# Altium project FMC_DAC_PSU.PrjPCB
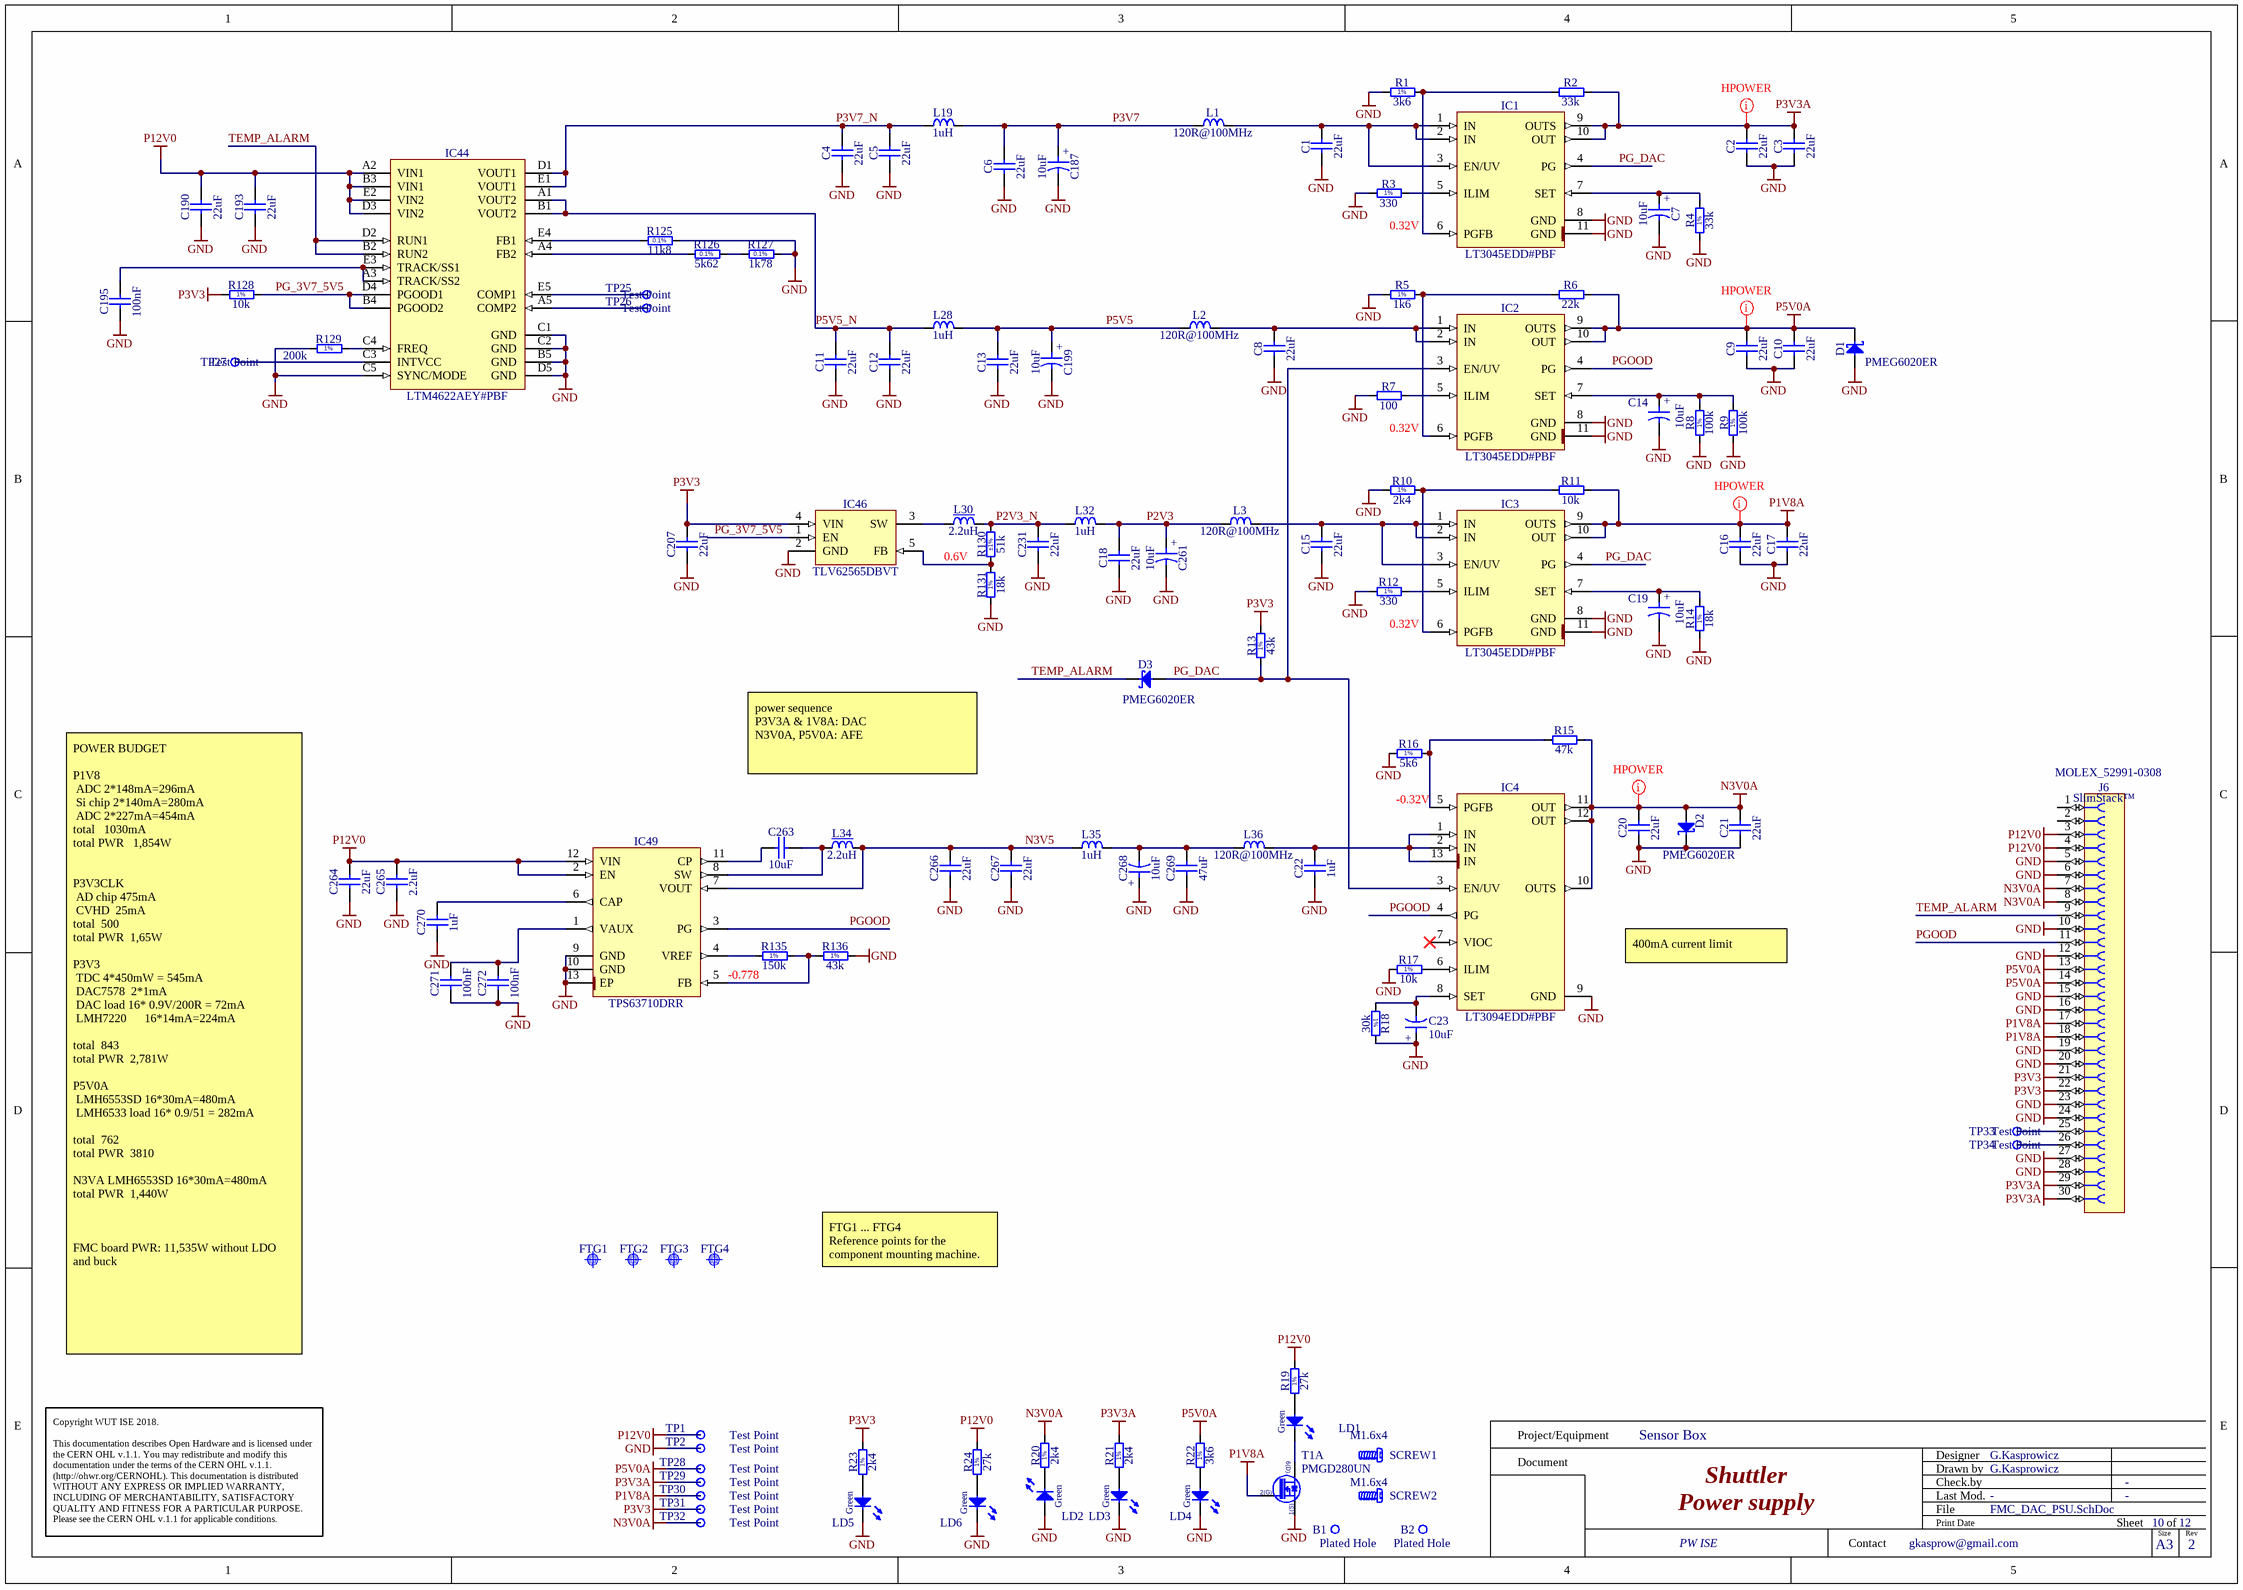
[diagram p0: FMC_DAC_PSU.SchDoc]
P_version: 1.2
1 sheet, 122 parts. Net scope: hierarchical (ports join the sheet entries above them; power ports are global).
Board file: FMC_DAC_PSU.PcbDoc

## Sheet FMC_DAC_PSU.SchDoc: Shuttler
size 420 x 297 mm; Author: G.Kasprowicz; CompanyName: WUT ISE; DrawnBy: G.Kasprowicz; Organization: WUT ISE; Address1: PW ISE; Address2: Nowowiejska 15/19 00-665 Warsaw; Address3: gkasprow@gmail.com; DocumentNumber: 10; Revision: 2; SheetNumber: 10; SheetTotal: 12; ModifiedBy: -; CheckedDate: -; Title2: Power supply; DivGrp: WUT ISE; Designer: G.Kasprowicz; ModifiedDate: -; ProjectName: Sensor Box

### Parts
B1  Plated Hole  [c300h160]  (no BOM)
B2  Plated Hole  [c300h160]  (no BOM)
C1  22uF  [CAPC2012X135N]
C2  22uF  [CAPC2012X135N]
C3  22uF  [CAPC2012X135N]
C4  22uF  [CAPC2012X135N]
C5  22uF  [CAPC2012X135N]
C6  22uF  [CAPC2012X135N]
C7  10uF  [CAPMP3216X180N]
C8  22uF  [CAPC2012X135N]
C9  22uF  [CAPC2012X135N]
C10  22uF  [CAPC2012X135N]
C11  22uF  [CAPC2012X135N]
C12  22uF  [CAPC2012X135N]
C13  22uF  [CAPC2012X135N]
C14  10uF  [CAPMP3216X180N]
C15  22uF  [CAPC2012X135N]
C16  22uF  [CAPC2012X135N]
C17  22uF  [CAPC2012X135N]
C18  22uF  [CAPC2012X135N]
C19  10uF  [CAPMP3216X180N]
C20  22uF  [CAPC2012X135N]
C21  22uF  [CAPC2012X135N]
C22  1uF  [CAPC1608X87N]
C23  10uF  [CAPMP3216X180N]
C187  10uF  [CAPMP3216X180N]
C190  22uF  [CAPC2012X135N]
C193  22uF  [CAPC2012X135N]
C195  100nF  [CAPC1005X55N]
C199  10uF  [CAPMP3216X180N]
C207  22uF  [CAPC2012X135N]
C231  22uF  [CAPC2012X135N]
C261  10uF  [CAPMP3216X180N]
C263  10uF  [CAPC2012X135N]
C264  22uF  [CAPC2012X135N]
C265  2.2uF  [CAPC1608X87N]
C266  22uF  [CAPC2012X135N]
C267  22uF  [CAPC2012X135N]
C268  10uF  [CAPMP3216X180N]
C269  47uF  [CAPC2012X140N]
C270  1uF  [CAPC1608X87N]
C271  100nF  [CAPC1005X55N]
C272  100nF  [CAPC1005X55N]
D1  PMEG6020ER  [SODFL3517X110N]
D2  PMEG6020ER  [SODFL3517X110N]
D3  PMEG6020ER  [SODFL3517X110N]
FTG1  Use only in PCB  [FIDUCIAL_TOP_S100-200]  (value not drawn)
FTG2  Use only in PCB  [FIDUCIAL_TOP_C100-200]  (value not drawn)
FTG3  Use only in PCB  [FIDUCIAL_TOP_S100-200]  (value not drawn)
FTG4  Use only in PCB  [FIDUCIAL_TOP_C100-200]  (value not drawn)
IC1  LT3045EDD#PBF  [SON50P300X300X80-11N-R175X248]
IC2  LT3045EDD#PBF  [SON50P300X300X80-11N-R175X248]
IC3  LT3045EDD#PBF  [SON50P300X300X80-11N-R175X248]
IC4  LT3094EDD#PBF  [SON45P300X300X80-13N-R175X248]
IC44  LTM4622AEY#PBF  [BGA25C127P5X5_625X625X262]
IC46  TLV62565DBVT  [SOT95P280X145-5N]
IC49  TPS63710DRR  [SON50P300X300X80-13N-R160X260]
J6  SlimStack™  [MOLEX_52991-0308]
L1  120R@100MHz  [INDC1608X65N]
L2  120R@100MHz  [INDC1608X65N]
L3  120R@100MHz  [INDC1608X65N]
L19  1uH  [INDC2620X100N]
L28  1uH  [INDC2620X100N]
L30  2.2uH  [IND_WURTH_WE-TPC_4828]
L32  1uH  [INDC2620X100N]
L34  2.2uH  [IND_WURTH_WE-TPC_4828]
L35  1uH  [INDC2620X100N]
L36  120R@100MHz  [INDC1608X65N]
LD1  Green  [LED_KINGBRIGHT_KPH-1608CGCK]
LD2  Green  [LED_KINGBRIGHT_KPH-1608CGCK]
LD3  Green  [LED_KINGBRIGHT_KPH-1608CGCK]
LD4  Green  [LED_KINGBRIGHT_KPH-1608CGCK]
LD5  Green  [LED_KINGBRIGHT_KPH-1608CGCK]
LD6  Green  [LED_KINGBRIGHT_KPH-1608CGCK]
R1  3k6  [RESC1005X40N]
R2  33k  [RESC1005X40N]
R3  330  [RESC1005X40N]
R4  33k  [RESC1608X55N]
R5  1k6  [RESC1005X40N]
R6  22k  [RESC1005X40N]
R7  100  [RESC1005X40N]
R8  100k  [RESC1005X40N]
R9  100k  [RESC1005X40N]
R10  2k4  [RESC1005X40N]
R11  10k  [RESC1005X40N]
R12  330  [RESC1005X40N]
R13  43k  [RESC1005X40N]
R14  18k  [RESC1608X55N]
R15  47k  [RESC1005X40N]
R16  5k6  [RESC1005X40N]
R17  10k  [RESC1005X40N]
R18  30k  [RESC1608X55N]
R19  27k  [RESC1005X40N]
R20  2k4  [RESC1005X40N]
R21  2k4  [RESC1005X40N]
R22  3k6  [RESC1005X40N]
R23  2k4  [RESC1005X40N]
R24  27k  [RESC1005X40N]
R125  11k8  [RESC1608X55N]
R126  5k62  [RESC1608X55N]
R127  1k78  [RESC1608X55N]
R128  10k  [RESC1005X40N]
R129  200k  [RESC1005X40N]
R130  51k  Tolerance: ±1%  [RESC1005X40N]
R131  18k  [RESC1005X40N]
R135  150k  [RESC1005X40N]
R136  43k  [RESC1005X40N]
SCREW1  M1.6x4  [BOSSARD_B1.6X4/BN660_v]
SCREW2  M1.6x4  [BOSSARD_B1.6X4/BN660_v]
T1  PMGD280UN  [SOT65P210X110-6N]  (part A of 2)
TP1  Test Point  [TPS127]  (no BOM)
TP2  Test Point  [TPS127]  (no BOM)
TP25  Test Point  [TPS127]  (no BOM)
TP26  Test Point  [TPS127]  (no BOM)
TP27  Test Point  [TPS127]  (no BOM)
TP28  Test Point  [TPS127]  (no BOM)
TP29  Test Point  [TPS127]  (no BOM)
TP30  Test Point  [TPS127]  (no BOM)
TP31  Test Point  [TPS127]  (no BOM)
TP32  Test Point  [TPS127]  (no BOM)
TP33  Test Point  [TPS127]  (no BOM)
TP34  Test Point  [TPS127]  (no BOM)

### Nets
GND: C1.1 C2.1 C3.1 C4.1 C5.1 C6.1 C7.2 C8.1 C9.1 C10.1 C11.1 C12.1 C13.1 C14.2 C15.1 C16.1 C17.1 C18.1 C19.2 C20.1 C21.1 C22.1 C23.1 C187.2 C190.1 C193.1 C195.1 C199.2 C207.1 C231.1 C261.2 C264.1 C265.1 C266.1 C267.1 C268.1 C269.1 C270.1 C271.1 C272.1 D1.2(A) D2.1(C) IC1.8(GND) IC1.11(GND) IC2.8(GND) IC2.11(GND) IC3.8(GND) IC3.11(GND) IC4.9(GND) IC44.B5(GND) IC44.C1(GND) IC44.C2(GND) IC44.C5(SYNC/MODE) IC44.D5(GND) IC46.2(GND) IC49.9(GND) IC49.10(GND) IC49.13(EP) J6.5 J6.6 J6.10 J6.12 J6.15 J6.16 J6.19 J6.20 J6.23 J6.24 J6.27 J6.28 LD2.2(A) LD3.1(C) LD4.1(C) LD5.1(C) LD6.1(C) R1.1 R3.1 R4.1 R5.1 R7.1 R8.1 R9.1 R10.1 R12.1 R14.1 R16.1 R17.1 R18.2 R125.2 R127.2 R129.1 R131.1 R136.2 T1.1(S) TP2.1
N3V0A: C20.2 C21.2 D2.2(A) IC4.10(OUTS) IC4.11(OUT) IC4.12(OUT) J6.7 J6.8 R15.2 R20.2 TP32.1
P1V8A: C16.2 C17.2 IC3.9(OUTS) IC3.10(OUT) J6.17 J6.18 R11.2 T1.2(G) TP30.1
P3V3: C207.2 IC46.4(VIN) J6.21 J6.22 R13.2 R23.2 R128.1 TP31.1
P3V3A: C2.2 C3.2 IC1.9(OUTS) IC1.10(OUT) J6.29 J6.30 R2.2 R21.2 TP29.1
P5V0A: C9.2 C10.2 D1.1(C) IC2.9(OUTS) IC2.10(OUT) J6.13 J6.14 R6.2 R22.2 TP28.1
P12V0: C190.2 C193.2 C264.2 C265.2 IC44.A2(VIN1) IC44.B3(VIN1) IC44.D3(VIN2) IC44.E2(VIN2) IC49.2(EN) IC49.12(VIN) J6.3 J6.4 R19.2 R24.2 TP1.1
N3V5: C266.2 C267.2 IC49.7(VOUT) L34.2 L35.1
P2V3: C18.2 C261.1 L3.1 L32.2
P2V3_N: C231.2 L30.2 L32.1 R130.2
P3V7: C6.2 C187.1 L1.1 L19.2
P3V7_N: C4.2 C5.2 IC44.D1(VOUT1) IC44.E1(VOUT1) L19.1
P5V5: C13.2 C199.1 L2.1 L28.2
P5V5_N: C11.2 C12.2 IC44.A1(VOUT2) IC44.B1(VOUT2) L28.1
PG_3V7_5V5: IC44.B4(PGOOD2) IC44.D4(PGOOD1) IC46.1(EN) R128.2
PG_DAC: D3.2(A) IC1.4(PG) IC2.3(EN/UV) IC3.4(PG) IC4.3(EN/UV) R13.1
PGOOD: IC2.4(PG) IC4.4(PG) IC49.3(PG) J6.11
TEMP_ALARM: D3.1(C) IC44.B2(RUN2) IC44.D2(RUN1) J6.9
NetC1_2: C1.2 IC1.1(IN) IC1.2(IN) IC1.3(EN/UV) L1.2
NetC7_1: C7.1 IC1.7(SET) R4.2
NetC8_2: C8.2 IC2.1(IN) IC2.2(IN) L2.2
NetC14_1: C14.1 IC2.7(SET) R8.2 R9.2
NetC15_2: C15.2 IC3.1(IN) IC3.2(IN) IC3.3(EN/UV) L3.2
NetC19_1: C19.1 IC3.7(SET) R14.2
NetC22_2: C22.2 IC4.1(IN) IC4.2(IN) IC4.13(IN) L36.2
NetC23_2: C23.2 IC4.8(SET) R18.1
NetC195_2: C195.2 IC44.A3(TRACK/SS2) IC44.E3(TRACK/SS1)
NetC263_1: C263.1 IC49.11(CP)
NetC263_2: C263.2 IC49.8(SW) L34.1
NetC268_2: C268.2 C269.2 L35.2 L36.1
NetC270_2: C270.2 IC49.6(CAP)
NetC271_2: C271.2 C272.2 IC49.1(VAUX)
NetIC1_5: IC1.5(ILIM) R3.2
NetIC1_6: IC1.6(PGFB) R1.2 R2.1
NetIC2_5: IC2.5(ILIM) R7.2
NetIC2_6: IC2.6(PGFB) R5.2 R6.1
NetIC3_5: IC3.5(ILIM) R12.2
NetIC3_6: IC3.6(PGFB) R10.2 R11.1
NetIC4_5: IC4.5(PGFB) R15.1 R16.2
NetIC4_6: IC4.6(ILIM) R17.2
NetIC44_A4: IC44.A4(FB2) R126.1
NetIC44_A5: IC44.A5(COMP2) TP26.1
NetIC44_C3: IC44.C3(INTVCC) TP27.1
NetIC44_C4: IC44.C4(FREQ) R129.2
NetIC44_E4: IC44.E4(FB1) R125.1
NetIC44_E5: IC44.E5(COMP1) TP25.1
NetIC46_3: IC46.3(SW) L30.1
NetIC46_5: IC46.5(FB) R130.1 R131.2
NetIC49_4: IC49.4(VREF) R135.1
NetIC49_5: IC49.5(FB) R135.2 R136.1
NetJ6_25: J6.25 TP33.1
NetJ6_26: J6.26 TP34.1
NetLD1_1: LD1.1(C) T1.6(D)
NetLD1_2: LD1.2(A) R19.1
NetLD2_1: LD2.1(C) R20.1
NetLD3_2: LD3.2(A) R21.1
NetLD4_2: LD4.2(A) R22.1
NetLD5_2: LD5.2(A) R23.1
NetLD6_2: LD6.2(A) R24.1
NetR126_2: R126.2 R127.1

Not connected (* = marked no-connect by the designer): B1 1; B2 1; IC4 7(VIOC)*; J6 1 2

### Layout directives
net class Hpower: N3V0A, P1V8A, P3V3A, P5V0A

### Notes on the sheet
- 0.32V
- 0.6V
- power sequence
  P3V3A & 1V8A: DAC
  N3V0A, P5V0A: AFE
- -0.32V
- (near R135) -0.778
- 400mA current limit
- FTG1 ... FTG4
  Reference points for the component mounting machine.
- (near C264) POWER BUDGET
  P1V8
  ADC	2*148mA=296mA
  Si chip	2*140mA=280mA
  ADC	2*227mA=454mA
  total			1030mA
  total PWR			1,854W
  P3V3CLK
  AD chip	475mA
  CVHD 	25mA
  total		500
  total PWR		1,65W
  P3V3
  TDC	4*450mW = 545mA
  DAC7578	 2*1mA
  DAC load	16* 0.9V/200R = 72mA
  LMH7220	     16*14mA=224mA
  total		843
  total PWR		2,781W
  P5V0A
  LMH6553SD 16*30mA=480mA
  LMH6533 load 16* 0.9/51 = 282mA
  total		762
  total PWR		3810
  N3VA	LMH6553SD 16*30mA=480mA
  total PWR		1,440W
  FMC board PWR: 11,535W without LDO and buck
- Project/Equipment
- Document
- Designer
- Drawn by
- Check.by
- Copyright WUT ISE 2018.
  This documentation describes Open Hardware and is licensed under the CERN OHL v.1.1. You may redistribute and modify this documentation under the terms of the CERN OHL v.1.1. (http://ohwr.org/CERNOHL). This documentation is distributed WITHOUT ANY EXPRESS OR IMPLIED WARRANTY, INCLUDING OF MERCHANTABILITY, SATISFACTORY QUALITY AND FITNESS FOR A PARTICULAR PURPOSE. Please see the CERN OHL v.1.1 for applicable conditions.
- Contact
- File
- Last Mod.
- Print Date
- Sheet
- Size
- A3
- of
- Rev
- (in symbol CTE3216-18_10UF_10V_10%_LESR1800) +
- (in symbol CTE3216-18_10UF_16V_20%_AVX_TCJ) +
- (in symbol PMGD280UN, part A) 6(D); 2(G); 1(S)
- (in symbol R0402_1K6_1%_0.0625W_100PPM) 1%
- (in symbol R0402_2K4_1%_0.0625W_100PPM) 1%
- (in symbol R0402_3K6_1%_0.0625W_100PPM) 1%
- (in symbol R0402_5K6_1%_0.0625W_100PPM) 1%
- (in symbol R0402_10K_1%_0.0625W_100PPM) 1%
- (in symbol R0402_10k_1%_0.0625W_100PPM) 1%
- (in symbol R0402_18K_1%_0.0625W_100PPM) 1%
- (in symbol R0402_27K_1%_0.0625W_100PPM) 1%
- (in symbol R0402_43K_1%_0.0625W_100PPM) 1%
- (in symbol R0402_100K_1%_0.0625W_100PPM) 1%
- (in symbol R0402_150K_1%_0.0625W_100PPM) 1%
- (in symbol R0402_200K_1%_0.0625W_100PPM) 1%
- (in symbol R0402_330R_1%_0.0625W_100PPM) 1%
- (in symbol R0603_1K78_0.1%_0.063W_10PPM) 0.1%
- (in symbol R0603_5K62_0.1%_0.063W_10PPM) 0.1%
- (in symbol R0603_11K8_0.1%_0.063W_10PPM) 0.1%
- (in symbol R0603_18k_1%_0.1W_100PPM) 1%
- (in symbol R0603_30k_1%_0.1W_100PPM) 1%
- (in symbol R0603_33k_1%_0.1W_100PPM) 1%

### Library data of the parts
B1 B2 = PLATED_HOLE1.6_PAD3.0: Single Terminal Socket; Part Description: Plated Through Hole: Hole Dia.=1.6mm Pad Dia.=3.0mm; Mounted: No; Part Number: PLATED_HOLE1.6_PAD3.0; Component Type: Standard (No BOM); Pin Count: 1; Family: Plated Hole; Socket: No; SMD: No; Sense: No; Status: None; ComponentHeight: 0mm; HelpURL: Undefined; Author: CERN DEM JMW; CreateDate: 05.11.2009; LatestRevisionDate: 05.11.2009; PackageDescription: Plated Through Hole: Hole Dia.=1.6mm Pad Dia.=3.0mm
C1-C6 C8-C13 C15-C18 C20 C21 C190 C193 C207 C231 C264 C266 C267 = CC0805_22UF_16V_10%_X5R: Non-polarised capacitor; Part Description: SMD Multilayer Chip Ceramic Capacitor; Manufacturer: GENERIC; Manufacturer1 Part Number: C2012X5R1C226KT; Voltage: 16V; TC: X5R; Tolerance: ±10%; Part Number: CC0805_22UF_16V_10%_X5R; Component Kind: Standard; Component Type: Standard; Pin Count: 2; Value: 22uF; Status: Preferred; Manufacturer Part Number: CC0805_22UF_16V_10%_X5R; Case: 0805; Mounted: Yes; Socket: No; SMD: Yes; Sense: No; Manufacturer1 Example: TDK; Manufacturer1 ComponentHeight: 1.35mm; HelpURL: \\cern.ch\dfs\Applications\Altium\Datasheets\CC0805_X5R_TDK_C.pdf; Author: CERN DEM JLC; CreateDate: 25.10.2012; LatestRevisionDate: 25.10.2012
C7 C14 C19 C23 = CTE3216-18_10UF_16V_20%_AVX_TCJ: Polarised capacitor; Part Description: ESR 0R200 Tantalum Solid Electrolytic Chip Capacitor with Conductive Polymer Electrode; Manufacturer: AVX; Manufacturer Part Number: TCJA106M016R0200; Voltage: 16V; Tolerance: ±20%; Part Number: CTE3216-18_10UF_16V_20%_AVX_TCJ; Component Kind: Standard; Component Type: Standard; Pin Count: 2; Value: 10uF; Status: Preferred; Case: A; Mounted: Yes; Socket: No; SMD: Yes; Sense: No; ComponentHeight: 1.8mm; HelpURL: \\cern.ch\dfs\Applications\Altium\Datasheets\CTE_AVX_TCJ.pdf; Author: CERN DEM JLC; CreateDate: 29.03.2012; LatestRevisionDate: 29.03.2012
C22 = CC0603_1UF_25V_10%_X7R: Non-polarised capacitor; Part Description: SMD Multilayer Chip Ceramic Capacitor; Manufacturer: GENERIC; Manufacturer1 Part Number: GRM188R71E105KA12D; Voltage: 25V; TC: X7R; Tolerance: ±10%; Part Number: CC0603_1UF_25V_10%_X7R; Component Kind: Standard; Component Type: Standard; Pin Count: 2; Value: 1uF; Status: None; Manufacturer Part Number: CC0603_1UF_25V_10%_X7R; Case: 0603; Mounted: Yes; Socket: No; SMD: Yes; Sense: No; Manufacturer1 Example: MURATA; Manufacturer1 ComponentHeight: 0.9mm; HelpURL: \\cern.ch\dfs\Applications\Altium\Datasheets\CC0603_X7R_MURATA.pdf; Author: CERN DEM JLC; CreateDate: 18.01.2011; LatestRevisionDate: 18.01.2011
C187 C199 C261 C268 = CTE3216-18_10UF_10V_10%_LESR1800: Polarised capacitor; Part Description: Low ESR 1R8 Solid Tantalum Chip Capacitor; Manufacturer: GENERIC; Manufacturer1 Part Number: TPSA106K010R1800; Voltage: 10V; Tolerance: ±10%; Part Number: CTE3216-18_10UF_10V_10%_LESR1800; Component Kind: Standard; Component Type: Standard; Pin Count: 2; Value: 10uF; Status: Preferred; Manufacturer Part Number: CTE3216-18_10UF_10V_10%_LESR1800; Case: A; Mounted: Yes; Socket: No; SMD: Yes; Sense: No; Manufacturer1 Example: AVX; Manufacturer1 ComponentHeight: 1.8mm; HelpURL: \\cern.ch\dfs\Applications\Altium\Datasheets\CTE-LESR_AVX_TPS.pdf; Author: CERN DEM JLC; CreateDate: 05.05.2008; LatestRevisionDate: 20.01.2009
C195 C271 C272 = CC0402_100NF_16V_10%_X5R: Non-polarised capacitor; Part Description: SMD Multilayer Chip Ceramic Capacitor; Manufacturer: GENERIC; Manufacturer1 Part Number: GRM155R61C104KA88D; Voltage: 16V; TC: X5R; Tolerance: ±10%; Part Number: CC0402_100NF_16V_10%_X5R; Component Kind: Standard; Component Type: Standard; Pin Count: 2; Value: 100nF; Status: None; Manufacturer Part Number: CC0402_100NF_16V_10%_X5R; Case: 0402; Mounted: Yes; Socket: No; SMD: Yes; Sense: No; Manufacturer1 Example: MURATA; Manufacturer1 ComponentHeight: 0.55mm; HelpURL: \\cern.ch\dfs\Applications\Altium\Datasheets\CC0402_X5R_MURATA_GRM.pdf; Author: CERN DEM JLC; CreateDate: 10.12.2013; LatestRevisionDate: 10.12.2013
C263 = CC0805_10UF_16V_10%_X5R: Non-polarised capacitor; Part Description: SMD Multilayer Chip Ceramic Capacitor; Manufacturer: GENERIC; Manufacturer1 Part Number: C0805C106K4PAC; Voltage: 16V; TC: X5R; Tolerance: ±10%; Part Number: CC0805_10UF_16V_10%_X5R; Component Kind: Standard; Component Type: Standard; Pin Count: 2; Value: 10uF; Status: Preferred; Manufacturer Part Number: CC0805_10UF_16V_10%_X5R; Case: 0805; Mounted: Yes; Socket: No; SMD: Yes; Sense: No; Manufacturer1 Example: KEMET; Manufacturer1 ComponentHeight: 1.4mm; HelpURL: \\cern.ch\dfs\Applications\Altium\Datasheets\CC1206_X5R_KEMET.pdf; Author: CERN DEM JLC; CreateDate: 03.12.2007; LatestRevisionDate: 03.12.2007
C265 = CC0603_2.2UF_16V_10%_X5R: Non-polarised capacitor; Part Description: SMD Multilayer Chip Ceramic Capacitor; Manufacturer: GENERIC; Manufacturer1 Part Number: CC0603KRX5R7BB225; Voltage: 16V; TC: X5R; Tolerance: ±10%; Part Number: CC0603_2.2UF_16V_10%_X5R; Component Kind: Standard; Component Type: Standard; Pin Count: 2; Value: 2.2uF; Status: Preferred; Manufacturer Part Number: CC0603_2.2UF_16V_10%_X5R; Case: 0603; Mounted: Yes; Socket: No; SMD: Yes; Sense: No; Manufacturer1 Example: YAGEO; Manufacturer1 ComponentHeight: 0.9mm; HelpURL: \\cern.ch\dfs\Applications\Altium\Datasheets\CC0805_X5R_PHYCOMP_HC.pdf; Author: CERN DEM JLC; CreateDate: 28.04.2011; LatestRevisionDate: 28.04.2011
C269 = CC0805_47UF_6.3V_20%_X5R: Non-polarised capacitor; Part Description: SMD Multilayer Chip Ceramic Capacitor; Manufacturer: GENERIC; Manufacturer1 Part Number: C0805C476M9PACTU; Voltage: 6.3V; TC: X5R; Tolerance: ±20%; Part Number: CC0805_47UF_6.3V_20%_X5R; Component Kind: Standard; Component Type: Standard; Pin Count: 2; Value: 47uF; Status: Preferred; Manufacturer Part Number: CC0805_47UF_6.3V_20%_X5R; Case: 0805; Mounted: Yes; Socket: No; SMD: Yes; Sense: No; Manufacturer1 Example: KEMET; Manufacturer1 ComponentHeight: 1.4mm; HelpURL: \\cern.ch\dfs\Applications\Altium\Datasheets\CC0805_X5R_KEMET.pdf; Author: CERN DEM JLC; CreateDate: 16.10.2012; LatestRevisionDate: 16.10.2012
C270 = CC0603_1UF_16V_10%_X7R: Non-polarised capacitor; Part Description: SMD Multilayer Chip Ceramic Capacitor; Manufacturer: GENERIC; Manufacturer1 Part Number: 223878615663; Voltage: 16V; TC: X7R; Tolerance: ±10%; Part Number: CC0603_1UF_16V_10%_X7R; Component Kind: Standard; Component Type: Standard; Pin Count: 2; Value: 1uF; Status: None; Manufacturer Part Number: CC0603_1uF_16V_10%_X7R; Case: 0603; Mounted: Yes; Socket: No; SMD: Yes; Sense: No; Manufacturer1 Example: YAGEO PHYCOMP; Manufacturer1 ComponentHeight: 0.9mm; HelpURL: \\cern.ch\dfs\Applications\Altium\Datasheets\CC0603_X7R_PHYCOMP.pdf; Author: CERN DEM JLC; CreateDate: 03.12.2007; LatestRevisionDate: 17.04.2015
D1-D3 = PMEG6020ER: Schottky Diode; Part Description: MEGA Schottky Barrier Rectifier; Manufacturer: NXP SEMICONDUCTORS; Voltage: 60V; Power: 2A; PressFit: No; Bonding: No; Part Number: PMEG6020ER; Component Kind: Standard; Component Type: Standard; Device: PMEG6020ER; PackageDescription: SODFL Diode (SOD123W); 2.60mm W X 1.70mm L X 1.10mm H body, IPC Medium Density; Manufacturer Part Number: PMEG6020ER; Pin Count: 2; Case: SOD123; Mounted: Yes; Socket: No; SMD: Yes; Sense: No; ComponentHeight: 0.65mm; HelpURL: \\cern.ch\dfs\Applications\Altium\Datasheets\PMEG6020ER.pdf; Author: CERN DEM JMW; CreateDate: 19.06.2014; LatestRevisionDate: 19.06.2014
FTG1 FTG3 = FIDUCIAL_TARGET_S100-200: Fiducial Target; Part Description: Square Fiducial Target, Top Layer, 1.0mm, Top Solder 2.0mm, Keepout =2.0mm; Mounted: No; Table: Pads; Part Number: FIDUCIAL_TARGET_S100-200; Component Kind: Standard (No BOM); Component Type: Standard (No BOM); Pin Count: 1; Family: Fiducial; Socket: No; SMD: Yes; Status: None; ComponentHeight: 0mm; Author: CERN DEM JLC; CreateDate: 9/2/2010; LatestRevisionDate: 4/4/2012; PackageDescription: Square Fiducial Target, Top Layer, 1.0mm, Top Solder 2.0mm, Keepout =2.0mm
FTG2 FTG4 = FIDUCIAL_TARGET_C100-200: Fiducial Target; Part Description: Round Fiducial Target, Top Layer, 1.0mm, Top Solder 2.0mm, Keepout =2.0mm; Mounted: No; Part Number: FIDUCIAL_TARGET_C100-200; Component Kind: Standard (No BOM); Component Type: Standard (No BOM); Pin Count: 1; Family: Fiducial; Socket: No; SMD: Yes; Sense: No; Status: None; ComponentHeight: 0mm; HelpURL: Undefined; Author: CERN DEM JLC; CreateDate: 09.02.2010; LatestRevisionDate: 04.04.2012; PackageDescription: Round Fiducial Target, Top Layer, 1.0mm, Top Solder 2.0mm, Keepout =2.0mm
IC1-IC3 = LT3045EDD#PBF: 20V, 500mA, Ultralow Noise, Ultrahigh PSRR Linear Regulator; Manufacturer: LINEAR TECHNOLOGY; PressFit: No; Bonding: No; Part Number: LT3045EDD#PBF; Component Kind: Standard; Component Type: Standard; Device: LT3045EDD#PBF; PackageDescription: SON, 0.50mm Pitch; 10-pin, 3.00mm W  X 3.00mm L X 0.80mm H Body, (w/thermal tab 1.75 X 2.48 mm), IPC Medium Density; Part Description: 20V, 500mA, Ultralow Noise, Ultrahigh PSRR Linear Regulator; Manufacturer Part Number: LT3045EDD#PBF; Pin Count: 11; Case: SON10; Mounted: Yes; Socket: No; SMD: Yes; Sense: No; ComponentHeight: 0.8mm; HelpURL: \\cern.ch\dfs\Applications\Altium\Datasheets\LT3045EDD#PBF.pdf; Author: CERN DEM JLC; CreateDate: 07.12.2016; LatestRevisionDate: 07.12.2016
IC4 = LT3094EDD#PBF: -20V, 500mA, Ultralow Noise, Ultrahigh PSRR Negative Linear Regulator; Manufacturer: LINEAR TECHNOLOGY; PressFit: No; Bonding: No; Part Number: LT3094EDD#PBF; Component Kind: Standard; Component Type: Standard; Device: LT3094EDD#PBF; PackageDescription: SON, 0.45mm Pitch; 12 Pin, 3.00mm W X 3.00mm L X 0.80mm H Body (w/Thermal tab 1.75 x 2.48mm), IPC Medium Density; Part Description: -20V, 500mA, Ultralow Noise, Ultrahigh PSRR Negative Linear Regulator; Manufacturer Part Number: LT3094EDD#PBF; Pin Count: 13; Case: SON12; Mounted: Yes; Socket: No; SMD: Yes; Sense: No; ComponentHeight: 0.8mm; HelpURL: \\cern.ch\dfs\Applications\Altium\Datasheets\LT3094EDD#PBF.pdf; Author: CERN DEM JLC; CreateDate: 12.11.2018; LatestRevisionDate: 12.11.2018
IC44 = LTM4622AEY#PBF: 3.6V-20V To 1.5V-12V, Dual 2A or Single 4A  Ultrathin Step-Down DC/DC µModule Regulator; Part Description: 3.6V-20V To 1.5V-12V, Dual 2A or Single 4A  Ultrathin Step-Down DC/DC uModule Regulator; Manufacturer: LINEAR TECHNOLOGY; PressFit: No; Bonding: No; Part Number: LTM4622AEY#PBF; Component Kind: Standard; Component Type: Standard; Device: LTM4622AEY#PBF; PackageDescription: BGA, 1.27mm Pitch, Square; 25 Pin, 5 Columns X 5 Rows, 6.25mm X 6.25mm X 2.62mm H; Manufacturer Part Number: LTM4622AEY#PBF; Pin Count: 25; Case: BGA25; Mounted: Yes; Socket: No; SMD: Yes; Sense: No; ComponentHeight: 2.62mm; HelpURL: \\cern.ch\dfs\Applications\Altium\Datasheets\LTM4622AEY#PBF.pdf; Author: CERN DEM MR; CreateDate: 29.09.2017; LatestRevisionDate: 29.09.2017
IC46 = TLV62565DBVT: 1.5A High Efficiency Step-Down Converter, Adjustable Output Voltage; Manufacturer: TEXAS INSTRUMENTS; PressFit: No; Bonding: No; Part Number: TLV62565DBVT; Component Kind: Standard; Component Type: Standard; Device: TLV62565DBVT; PackageDescription: SOT, 0.95mm Pitch; 5 Pin, 1.60mm W X 2.90mm L X 1.45mm H Body, IPC Medium Density; Part Description: 1.5A High Efficiency Step-Down Converter, Adjustable Output Voltage; Manufacturer Part Number: TLV62565DBVT; Pin Count: 5; Case: SOT23-5; Mounted: Yes; Socket: No; SMD: Yes; Sense: No; ComponentHeight: 1.45mm; HelpURL: \\cern.ch\dfs\Applications\Altium\Datasheets\TLV62565DBVT.pdf; Author: CERN DEM JMW; CreateDate: 29.08.2016; LatestRevisionDate: 29.08.2016
IC49 = TPS63710DRR: -1 to -5.5VDC, 1A Output, Low Noise Synchronous Inverting Buck Converter; Manufacturer: TEXAS INSTRUMENTS; PressFit: No; Bonding: No; Part Number: TPS63710DRR; Component Kind: Standard; Component Type: Standard; Device: TPS63710DRR; PackageDescription: SON, 0.50mm Pitch, 12-Pin, 3.00mm W  X 3.00mm L X 0.80mm Height, (w/Thermal Tab 1.6 X 2.6 mm), IPC Medium Density; Part Description: -1 to -5.5VDC, 1A Output, Low Noise Synchronous Inverting Buck Converter; Manufacturer Part Number: TPS63710DRR; Pin Count: 13; Case: SON12; Mounted: Yes; Socket: No; SMD: Yes; Sense: No; ComponentHeight: 0.8mm; HelpURL: \\cern.ch\dfs\Applications\Altium\Datasheets\TPS63710DRR.pdf; Author: CERN DEM BC; CreateDate: 11.02.2019; LatestRevisionDate: 11.02.2019
J6 = MOLEX_52991-0308: Connector 30 Female; Part Description: 0.50mm Pitch SlimStack™ Dual Row 30 Circuits Surface Mount Vertical Receptacle (3.00 and 4.00mm Stacking Heights); Manufacturer: MOLEX; PressFit: No; Part Number: MOLEX_52991-0308; Component Kind: Standard; Component Type: Standard; Pin Count: 30; Family: SlimStack™; Mounted: Yes; Socket: No; SMD: Yes; Sense: No; Status: None; Manufacturer Part Number: 52991-0308; ComponentHeight: 2.27mm; HelpURL: \\cern.ch\dfs\Applications\Altium\Datasheets\MOLEX_52991-0308.pdf; Author: CERN DEM JLC; CreateDate: 28.08.2012; LatestRevisionDate: 28.08.2012
L1-L3 L36 = IND0603_MURATA_BLM18SG121TN1D: Inductor; Part Description: SMD EMIFIL Suppression Chip Ferrite Bead; Manufacturer: MURATA; Power: 3A; Resistance: 0.025R; Tolerance: ±25%; Part Number: IND0603_MURATA_BLM18SG121TN1D; Component Kind: Standard; Component Type: Standard; Pin Count: 2; Value: 120R@100MHz; Status: None; Manufacturer Part Number: BLM18SG121TN1D; Case: 0603; Mounted: Yes; Socket: No; SMD: Yes; Sense: No; ComponentHeight: 0.65mm; HelpURL: \\cern.ch\dfs\Applications\Altium\Datasheets\IND0603_MURATA_BLM18S.pdf; Author: CERN DEM JLC; CreateDate: 23.07.2014; LatestRevisionDate: 23.07.2014
L19 L28 L32 L35 = IND1008_1UH_20%_WURTH_74479787210B: Inductor; Part Description: Power Multilayer Inductor (WE-PMI Series); Manufacturer: WURTH ELEKTRONIK; Power: 1.95A; Resistance: 0.06R; Tolerance: ±20%; Part Number: IND1008_1UH_20%_WURTH_74479787210B; Component Kind: Standard; Component Type: Standard; Pin Count: 2; Value: 1uH; Status: None; Manufacturer Part Number: 74479787210B; Mounted: Yes; Socket: No; SMD: Yes; Sense: No; ComponentHeight: 1mm; HelpURL: \\cern.ch\dfs\Applications\Altium\Datasheets\IND_WURTH_WE-PMI_74479787210B.pdf; Author: CERN DEM JLC; CreateDate: 01.10.2014; LatestRevisionDate: 01.10.2014; Case: 1008
L30 L34 = IND_2.2UH_30%_WURTH_WE-TPC_7440430022: Inductor With Core; Part Description: Shielded Tiny Power Inductor (WE-TPC Series); Manufacturer: WURTH ELEKTRONIK; Power: 2.5A; Resistance: 0.023R; Tolerance: ±30%; Part Number: IND_2.2UH_30%_WURTH_WE-TPC_7440430022; Component Kind: Standard; Component Type: Standard; Pin Count: 2; Value: 2.2uH; Status: None; Manufacturer Part Number: 7440430022; Mounted: Yes; Socket: No; SMD: Yes; Sense: No; ComponentHeight: 3mm; HelpURL: \\cern.ch\dfs\Applications\Altium\Datasheets\IND_WURTH_WE-TPC_7440430022.pdf; Author: CERN DEM JLC; CreateDate: 19.11.2012; LatestRevisionDate: 19.11.2012
LD1-LD6 = LED_KINGBRIGHT_KPH-1608CGCK: LED Green 1C 2A; Part Description: SMD Green LED, Case 1.6mmX0.8mm(0603), 0.65mm Thickness; PressFit: No; Bonding: No; Part Number: LED_KINGBRIGHT_KPH-1608CGCK; Component Kind: Standard; Component Type: Standard; Color: Green; PackageDescription: SMT Green LED, Case 0603, Body L 1.6 x W 0.8mm H 0.65mm; Manufacturer: KINGBRIGHT; Manufacturer Part Number: KPH-1608CGCK; Pin Count: 2; Mounted: Yes; Socket: No; SMD: Yes; Sense: No; ComponentHeight: 0.65mm; HelpURL: \\cern.ch\dfs\Applications\Altium\Datasheets\LED_KINGBRIGHT_KPH-1608CGCK.pdf; Author: CERN DEM JLC; CreateDate: 03.07.2017; LatestRevisionDate: 03.07.2017
R1 R22 = R0402_3K6_1%_0.0625W_100PPM: Resistor - 1%; Part Description: General Purpose Thick Film Chip Resistor; Manufacturer: GENERIC; Manufacturer1 Part Number: 232270673602L; TC: ±100ppm/°C; PressFit: No; Part Number: R0402_3K6_1%_0.0625W_100PPM; Component Kind: Standard; Component Type: Standard; Pin Count: 2; Value: 3k6; Status: Not Recommended; Power: 0.0625W; Tolerance: ±1%; Manufacturer Part Number: R0402_3K6_1%_0.0625W_100PPM; Case: 0402; Mounted: Yes; Sense: No; Socket: No; SMD: Yes; Manufacturer1 Example: YAGEO PHYCOMP; Manufacturer1 ComponentHeight: 0.4mm; HelpURL: \\cern.ch\dfs\Applications\Altium\Datasheets\R0402_Phycomp_RC0402.pdf; Author: CERN DEM JLC; CreateDate: 03/12/2007; LatestRevisionDate: 17/10/2012
R2 = R0402_33K_1%_0.0625W_100PPM: Resistor - 1%; Part Description: General Purpose Thick Film Chip Resistor; Manufacturer: GENERIC; Manufacturer1 Part Number: 232270673303L; TC: ±100ppm/°C; PressFit: No; Part Number: R0402_33K_1%_0.0625W_100PPM; Component Kind: Standard; Component Type: Standard; Pin Count: 2; Value: 33k; Status: Not Recommended; Power: 0.0625W; Tolerance: ±1%; Manufacturer Part Number: R0402_33K_1%_0.0625W_100PPM; Case: 0402; Mounted: Yes; Sense: No; Socket: No; SMD: Yes; Manufacturer1 Example: YAGEO PHYCOMP; Manufacturer1 ComponentHeight: 0.4mm; HelpURL: \\cern.ch\dfs\Applications\Altium\Datasheets\R0402_Phycomp_RC0402.pdf; Author: CERN DEM JLC; CreateDate: 03.12.2007; LatestRevisionDate: 17.10.2012
R3 R12 = R0402_330R_1%_0.0625W_100PPM: Resistor - 1%; Part Description: General Purpose Thick Film Chip Resistor; Manufacturer: GENERIC; Manufacturer1 Part Number: 232270673301L; TC: ±100ppm/°C; PressFit: No; Part Number: R0402_330R_1%_0.0625W_100PPM; Component Kind: Standard; Component Type: Standard; Pin Count: 2; Value: 330; Status: Not Recommended; Power: 0.0625W; Tolerance: ±1%; Manufacturer Part Number: R0402_330R_1%_0.0625W_100PPM; Case: 0402; Mounted: Yes; Sense: No; Socket: No; SMD: Yes; Manufacturer1 Example: YAGEO PHYCOMP; Manufacturer1 ComponentHeight: 0.4mm; HelpURL: \\cern.ch\dfs\Applications\Altium\Datasheets\R0402_Phycomp_RC0402.pdf; Author: CERN DEM JLC; CreateDate: 03.12.2007; LatestRevisionDate: 17.10.2012
R4 = R0603_33k_1%_0.1W_100PPM: Resistor - 1%; Part Description: General Purpose Thick Film Chip Resistor; Manufacturer: GENERIC; Manufacturer1 Part Number: NRC06F3302TRF; Power: 0.1W; TC: ±100ppm/°C; PressFit: No; Part Number: R0603_33K_1%_0.1W_100PPM; Component Kind: Standard; Component Type: Standard; Pin Count: 2; Value: 33k; Status: Preferred; Tolerance: ±1%; Manufacturer Part Number: R0603_33K_1%_0.1W_100PPM; Case: 0603; Mounted: Yes; Sense: No; Socket: No; SMD: Yes; Manufacturer1 Example: NIC COMPONENT; Manufacturer1 ComponentHeight: 0.55mm; HelpURL: \\cern.ch\dfs\Applications\Altium\Datasheets\R0603_NIC_NRC.pdf; Author: CERN DEM JLC; CreateDate: 03/12/2007; LatestRevisionDate: 13/03/2008
R5 = R0402_1K6_1%_0.0625W_100PPM: Resistor - 1%; Part Description: General Purpose Thick Film Chip Resistor; Manufacturer: GENERIC; Manufacturer1 Part Number: 232270671602L; TC: ±100ppm/°C; PressFit: No; Part Number: R0402_1K6_1%_0.0625W_100PPM; Component Kind: Standard; Component Type: Standard; Pin Count: 2; Value: 1k6; Status: Not Recommended; Power: 0.0625W; Tolerance: ±1%; Manufacturer Part Number: R0402_1K6_1%_0.0625W_100PPM; Case: 0402; Mounted: Yes; Sense: No; Socket: No; SMD: Yes; Manufacturer1 Example: YAGEO PHYCOMP; Manufacturer1 ComponentHeight: 0.4mm; HelpURL: \\cern.ch\dfs\Applications\Altium\Datasheets\R0402_Phycomp_RC0402.pdf; Author: CERN DEM JLC; CreateDate: 03/12/2007; LatestRevisionDate: 17/10/2012
R6 = R0402_22K_1%_0.0625W_100PPM: Resistor - 1%; Part Description: General Purpose Thick Film Chip Resistor; Manufacturer: GENERIC; Manufacturer1 Part Number: 232270672203L; TC: ±100ppm/°C; PressFit: No; Part Number: R0402_22K_1%_0.0625W_100PPM; Component Kind: Standard; Component Type: Standard; Pin Count: 2; Value: 22k; Status: Not Recommended; Power: 0.0625W; Tolerance: ±1%; Manufacturer Part Number: R0402_22K_1%_0.0625W_100PPM; Case: 0402; Mounted: Yes; Sense: No; Socket: No; SMD: Yes; Manufacturer1 Example: YAGEO PHYCOMP; Manufacturer1 ComponentHeight: 0.4mm; HelpURL: \\cern.ch\dfs\Applications\Altium\Datasheets\R0402_Phycomp_RC0402.pdf; Author: CERN DEM JLC; CreateDate: 03.12.2007; LatestRevisionDate: 17.10.2012
R7 = R0402_100R_1%_0.0625W_100PPM: Resistor - 1%; Part Description: General Purpose Thick Film Chip Resistor; Manufacturer: GENERIC; Manufacturer1 Part Number: 232270671001L; TC: ±100ppm/°C; PressFit: No; Part Number: R0402_100R_1%_0.0625W_100PPM; Component Kind: Standard; Component Type: Standard; Pin Count: 2; Value: 100; Status: Not Recommended; Power: 0.0625W; Tolerance: ±1%; Manufacturer Part Number: R0402_100R_1%_0.0625W_100PPM; Case: 0402; Mounted: Yes; Sense: No; Socket: No; SMD: Yes; Manufacturer1 Example: YAGEO PHYCOMP; Manufacturer1 ComponentHeight: 0.4mm; HelpURL: \\cern.ch\dfs\Applications\Altium\Datasheets\R0402_Phycomp_RC0402.pdf; Author: CERN DEM JLC; CreateDate: 03.12.2007; LatestRevisionDate: 17.10.2012
R8 R9 = R0402_100K_1%_0.0625W_100PPM: Resistor - 1%; Part Description: General Purpose Thick Film Chip Resistor; Manufacturer: GENERIC; Manufacturer1 Part Number: 232270671004L; TC: ±100ppm/°C; PressFit: No; Part Number: R0402_100K_1%_0.0625W_100PPM; Component Kind: Standard; Component Type: Standard; Pin Count: 2; Value: 100k; Status: Not Recommended; Power: 0.0625W; Tolerance: ±1%; Manufacturer Part Number: R0402_100K_1%_0.0625W_100PPM; Case: 0402; Mounted: Yes; Sense: No; Socket: No; SMD: Yes; Manufacturer1 Example: YAGEO PHYCOMP; Manufacturer1 ComponentHeight: 0.4mm; HelpURL: \\cern.ch\dfs\Applications\Altium\Datasheets\R0402_Phycomp_RC0402.pdf; Author: CERN DEM JLC; CreateDate: 03/12/2007; LatestRevisionDate: 17/10/2012
R10 R20 R21 R23 = R0402_2K4_1%_0.0625W_100PPM: Resistor - 1%; Part Description: General Purpose Thick Film Chip Resistor; Manufacturer: GENERIC; Manufacturer1 Part Number: 232270672402L; TC: ±100ppm/°C; PressFit: No; Part Number: R0402_2K4_1%_0.0625W_100PPM; Component Kind: Standard; Component Type: Standard; Pin Count: 2; Value: 2k4; Status: Not Recommended; Power: 0.0625W; Tolerance: ±1%; Manufacturer Part Number: R0402_2K4_1%_0.0625W_100PPM; Case: 0402; Mounted: Yes; Sense: No; Socket: No; SMD: Yes; Manufacturer1 Example: YAGEO PHYCOMP; Manufacturer1 ComponentHeight: 0.4mm; HelpURL: \\cern.ch\dfs\Applications\Altium\Datasheets\R0402_Phycomp_RC0402.pdf; Author: CERN DEM JLC; CreateDate: 03/12/2007; LatestRevisionDate: 17/10/2012
R11 R128 = R0402_10K_1%_0.0625W_100PPM: Resistor - 1%; Part Description: General Purpose Thick Film Chip Resistor; Manufacturer: GENERIC; Manufacturer1 Part Number: 232270671003L; TC: ±100ppm/°C; PressFit: No; Part Number: R0402_10K_1%_0.0625W_100PPM; Component Kind: Standard; Component Type: Standard; Pin Count: 2; Value: 10k; Status: Not Recommended; Power: 0.0625W; Tolerance: ±1%; Manufacturer Part Number: R0402_10K_1%_0.0625W_100PPM; Case: 0402; Mounted: Yes; Sense: No; Socket: No; SMD: Yes; Manufacturer1 Example: YAGEO PHYCOMP; Manufacturer1 ComponentHeight: 0.4mm; HelpURL: \\cern.ch\dfs\Applications\Altium\Datasheets\R0402_Phycomp_RC0402.pdf; Author: CERN DEM JLC; CreateDate: 03.12.2007; LatestRevisionDate: 17.10.2012
R13 R136 = R0402_43K_1%_0.0625W_100PPM: Resistor - 1%; Part Description: General Purpose Thick Film Chip Resistor; Manufacturer: GENERIC; Manufacturer1 Part Number: 232270674303L; TC: ±100ppm/°C; PressFit: No; Part Number: R0402_43K_1%_0.0625W_100PPM; Component Kind: Standard; Component Type: Standard; Pin Count: 2; Value: 43k; Status: Not Recommended; Power: 0.0625W; Tolerance: ±1%; Manufacturer Part Number: R0402_43K_1%_0.0625W_100PPM; Case: 0402; Mounted: Yes; Sense: No; Socket: No; SMD: Yes; Manufacturer1 Example: YAGEO PHYCOMP; Manufacturer1 ComponentHeight: 0.4mm; HelpURL: \\cern.ch\dfs\Applications\Altium\Datasheets\R0402_Phycomp_RC0402.pdf; Author: CERN DEM JLC; CreateDate: 03/12/2007; LatestRevisionDate: 17/10/2012
R14 = R0603_18k_1%_0.1W_100PPM: Resistor - 1%; Part Description: General Purpose Thick Film Chip Resistor; Manufacturer: GENERIC; Manufacturer1 Part Number: NRC06F1802TRF; Power: 0.1W; TC: ±100ppm/°C; PressFit: No; Part Number: R0603_18K_1%_0.1W_100PPM; Component Kind: Standard; Component Type: Standard; Pin Count: 2; Value: 18k; Status: Preferred; Tolerance: ±1%; Manufacturer Part Number: R0603_18K_1%_0.1W_100PPM; Case: 0603; Mounted: Yes; Sense: No; Socket: No; SMD: Yes; Manufacturer1 Example: NIC COMPONENT; Manufacturer1 ComponentHeight: 0.55mm; HelpURL: \\cern.ch\dfs\Applications\Altium\Datasheets\R0603_NIC_NRC.pdf; Author: CERN DEM JLC; CreateDate: 03/12/2007; LatestRevisionDate: 13/03/2008
R15 = R0402_47K_1%_0.0625W_100PPM: Resistor - 1%; Part Description: General Purpose Thick Film Chip Resistor; Manufacturer: GENERIC; Manufacturer1 Part Number: 232270674703L; TC: ±100ppm/°C; PressFit: No; Part Number: R0402_47K_1%_0.0625W_100PPM; Component Kind: Standard; Component Type: Standard; Pin Count: 2; Value: 47k; Status: Not Recommended; Power: 0.0625W; Tolerance: ±1%; Manufacturer Part Number: R0402_47K_1%_0.0625W_100PPM; Case: 0402; Mounted: Yes; Sense: No; Socket: No; SMD: Yes; Manufacturer1 Example: YAGEO PHYCOMP; Manufacturer1 ComponentHeight: 0.4mm; HelpURL: \\cern.ch\dfs\Applications\Altium\Datasheets\R0402_Phycomp_RC0402.pdf; Author: CERN DEM JLC; CreateDate: 03.12.2007; LatestRevisionDate: 17.10.2012
R16 = R0402_5K6_1%_0.0625W_100PPM: Resistor - 1%; Part Description: General Purpose Thick Film Chip Resistor; Manufacturer: GENERIC; Manufacturer1 Part Number: 232270675602L; TC: ±100ppm/°C; PressFit: No; Part Number: R0402_5K6_1%_0.0625W_100PPM; Component Kind: Standard; Component Type: Standard; Pin Count: 2; Value: 5k6; Status: Not Recommended; Power: 0.0625W; Tolerance: ±1%; Manufacturer Part Number: R0402_5K6_1%_0.0625W_100PPM; Case: 0402; Mounted: Yes; Sense: No; Socket: No; SMD: Yes; Manufacturer1 Example: YAGEO PHYCOMP; Manufacturer1 ComponentHeight: 0.4mm; HelpURL: \\cern.ch\dfs\Applications\Altium\Datasheets\R0402_Phycomp_RC0402.pdf; Author: CERN DEM JLC; CreateDate: 03/12/2007; LatestRevisionDate: 17/10/2012
R17 = R0402_10k_1%_0.0625W_100PPM: Resistor - 1%; Part Description: General Purpose Thick Film Chip Resistor; Manufacturer: GENERIC; Manufacturer1 Part Number: 232270671003L; TC: ±100ppm/°C; PressFit: No; Part Number: R0402_10K_1%_0.0625W_100PPM; Component Kind: Standard; Component Type: Standard; Pin Count: 2; Value: 10k; Status: Not Recommended; Power: 0.0625W; Tolerance: ±1%; Manufacturer Part Number: R0402_10K_1%_0.0625W_100PPM; Case: 0402; Mounted: Yes; Sense: No; Socket: No; SMD: Yes; Manufacturer1 Example: YAGEO PHYCOMP; Manufacturer1 ComponentHeight: 0.4mm; HelpURL: \\cern.ch\dfs\Applications\Altium\Datasheets\R0402_Phycomp_RC0402.pdf; Author: CERN DEM JLC; CreateDate: 03.12.2007; LatestRevisionDate: 17.10.2012
R18 = R0603_30k_1%_0.1W_100PPM: Resistor - 1%; Part Description: General Purpose Thick Film Chip Resistor; Manufacturer: GENERIC; Manufacturer1 Part Number: NRC06F3002TRF; Power: 0.1W; TC: ±100ppm/°C; PressFit: No; Part Number: R0603_30K_1%_0.1W_100PPM; Component Kind: Standard; Component Type: Standard; Pin Count: 2; Value: 30k; Status: Preferred; Tolerance: ±1%; Manufacturer Part Number: R0603_30K_1%_0.1W_100PPM; Case: 0603; Mounted: Yes; Sense: No; Socket: No; SMD: Yes; Manufacturer1 Example: NIC COMPONENT; Manufacturer1 ComponentHeight: 0.55mm; HelpURL: \\cern.ch\dfs\Applications\Altium\Datasheets\R0603_NIC_NRC.pdf; Author: CERN DEM JLC; CreateDate: 03/12/2007; LatestRevisionDate: 13/03/2008
R19 R24 = R0402_27K_1%_0.0625W_100PPM: Resistor - 1%; Part Description: General Purpose Thick Film Chip Resistor; Manufacturer: GENERIC; Manufacturer1 Part Number: 232270672703L; TC: ±100ppm/°C; PressFit: No; Part Number: R0402_27K_1%_0.0625W_100PPM; Component Kind: Standard; Component Type: Standard; Pin Count: 2; Value: 27k; Status: Not Recommended; Power: 0.0625W; Tolerance: ±1%; Manufacturer Part Number: R0402_27K_1%_0.0625W_100PPM; Case: 0402; Mounted: Yes; Sense: No; Socket: No; SMD: Yes; Manufacturer1 Example: YAGEO PHYCOMP; Manufacturer1 ComponentHeight: 0.4mm; HelpURL: \\cern.ch\dfs\Applications\Altium\Datasheets\R0402_Phycomp_RC0402.pdf; Author: CERN DEM JLC; CreateDate: 03/12/2007; LatestRevisionDate: 17/10/2012
R125 = R0603_11K8_0.1%_0.063W_10PPM: Resistor - 0.1%; Part Description: Thin Film Chip Resistor; Manufacturer: GENERIC; Manufacturer1 Part Number: RN73C1J11K8BTDF; Power: 0.063W; TC: ±10ppm; Part Number: R0603_11K8_0.1%_0.063W_10PPM; Component Kind: Standard; Component Type: Standard; Pin Count: 2; Value: 11k8; Status: Not recommended; Tolerance: ±0.1%; Manufacturer Part Number: R0603_11K8_0.1%_0.063W_10PPM; Case: 0603; Mounted: Yes; Sense: No; Socket: No; SMD: Yes; Manufacturer1 Example: TYCO HOLSWORTHY; Manufacturer1 ComponentHeight: 0.5mm; HelpURL: \\cern.ch\dfs\Applications\Altium\Datasheets\R0603_Tyco_RN73.pdf; Author: CERN DEM JLC; CreateDate: 03.12.2007; LatestRevisionDate: 13.03.2008
R126 = R0603_5K62_0.1%_0.063W_10PPM: Resistor - 0.1%; Part Description: Thin Film Chip Resistor; Manufacturer: GENERIC; Manufacturer1 Part Number: RN73C1J5K62BTDF; Power: 0.063W; TC: ±10ppm; Part Number: R0603_5K62_0.1%_0.063W_10PPM; Component Kind: Standard; Component Type: Standard; Pin Count: 2; Value: 5k62; Status: Not recommended; Tolerance: ±0.1%; Manufacturer Part Number: R0603_5K62_0.1%_0.063W_10PPM; Case: 0603; Mounted: Yes; Sense: No; Socket: No; SMD: Yes; Manufacturer1 Example: TYCO HOLSWORTHY; Manufacturer1 ComponentHeight: 0.5mm; HelpURL: \\cern.ch\dfs\Applications\Altium\Datasheets\R0603_Tyco_RN73.pdf; Author: CERN DEM JLC; CreateDate: 03.12.2007; LatestRevisionDate: 13.03.2008
R127 = R0603_1K78_0.1%_0.063W_10PPM: Resistor - 0.1%; Part Description: Thin Film Chip Resistor; Manufacturer: GENERIC; Manufacturer1 Part Number: RN73C1J1K78BTDF; Power: 0.063W; TC: ±10ppm; Part Number: R0603_1K78_0.1%_0.063W_10PPM; Component Kind: Standard; Component Type: Standard; Pin Count: 2; Value: 1k78; Status: Not recommended; Tolerance: ±0.1%; Manufacturer Part Number: R0603_1K78_0.1%_0.063W_10PPM; Case: 0603; Mounted: Yes; Sense: No; Socket: No; SMD: Yes; Manufacturer1 Example: TYCO HOLSWORTHY; Manufacturer1 ComponentHeight: 0.5mm; HelpURL: \\cern.ch\dfs\Applications\Altium\Datasheets\R0603_Tyco_RN73.pdf; Author: CERN DEM JLC; CreateDate: 03.12.2007; LatestRevisionDate: 13.03.2008
R129 = R0402_200K_1%_0.0625W_100PPM: Resistor - 1%; Part Description: General Purpose Thick Film Chip Resistor; Manufacturer: GENERIC; Manufacturer1 Part Number: 232270672004L; TC: ±100ppm/°C; Part Number: R0402_200K_1%_0.0625W_100PPM; Component Kind: Standard; Component Type: Standard; Pin Count: 2; Value: 200k; Status: Not recommended; Power: 0.0625W; Tolerance: ±1%; Manufacturer Part Number: R0402_200K_1%_0.0625W_100PPM; Case: 0402; Mounted: Yes; Sense: No; Socket: No; SMD: Yes; Manufacturer1 Example: YAGEO PHYCOMP; Manufacturer1 ComponentHeight: 0.4mm; HelpURL: \\cern.ch\dfs\Applications\Altium\Datasheets\R0402_Phycomp_RC0402.pdf; Author: CERN DEM JLC; CreateDate: 03.12.2007; LatestRevisionDate: 17.10.2012
R130 = R0402_51K_1%_0.0625W_100PPM: Resistor - 1%; Part Description: General Purpose Thick Film Chip Resistor; Manufacturer: GENERIC; Manufacturer1 Part Number: 232270675103L; TC: ±100ppm/°C; PressFit: No; Part Number: R0402_51K_1%_0.0625W_100PPM; Component Kind: Standard; Component Type: Standard; Pin Count: 2; Value: 51k; Status: Not Recommended; Power: 0.0625W; Manufacturer Part Number: R0402_51K_1%_0.0625W_100PPM; Case: 0402; Mounted: Yes; Sense: No; Socket: No; SMD: Yes; Manufacturer1 Example: YAGEO PHYCOMP; Manufacturer1 ComponentHeight: 0.4mm; HelpURL: \\cern.ch\dfs\Applications\Altium\Datasheets\R0402_Phycomp_RC0402.pdf; Author: CERN DEM JLC; CreateDate: 03.12.2007; LatestRevisionDate: 17.10.2012
R131 = R0402_18K_1%_0.0625W_100PPM: Resistor - 1%; Part Description: General Purpose Thick Film Chip Resistor; Manufacturer: GENERIC; Manufacturer1 Part Number: 232270671803L; TC: ±100ppm/°C; PressFit: No; Part Number: R0402_18K_1%_0.0625W_100PPM; Component Kind: Standard; Component Type: Standard; Pin Count: 2; Value: 18k; Status: Not Recommended; Power: 0.0625W; Tolerance: ±1%; Manufacturer Part Number: R0402_18K_1%_0.0625W_100PPM; Case: 0402; Mounted: Yes; Sense: No; Socket: No; SMD: Yes; Manufacturer1 Example: YAGEO PHYCOMP; Manufacturer1 ComponentHeight: 0.4mm; HelpURL: \\cern.ch\dfs\Applications\Altium\Datasheets\R0402_Phycomp_RC0402.pdf; Author: CERN DEM JLC; CreateDate: 03/12/2007; LatestRevisionDate: 17/10/2012
R135 = R0402_150K_1%_0.0625W_100PPM: Resistor - 1%; Part Description: General Purpose Thick Film Chip Resistor; Manufacturer: GENERIC; Manufacturer1 Part Number: 232270671504L; TC: ±100ppm/°C; PressFit: No; Part Number: R0402_150K_1%_0.0625W_100PPM; Component Kind: Standard; Component Type: Standard; Pin Count: 2; Value: 150k; Status: Not Recommended; Power: 0.0625W; Tolerance: ±1%; Manufacturer Part Number: R0402_150K_1%_0.0625W_100PPM; Case: 0402; Mounted: Yes; Sense: No; Socket: No; SMD: Yes; Manufacturer1 Example: YAGEO PHYCOMP; Manufacturer1 ComponentHeight: 0.4mm; HelpURL: \\cern.ch\dfs\Applications\Altium\Datasheets\R0402_Phycomp_RC0402.pdf; Author: CERN DEM JLC; CreateDate: 03/12/2007; LatestRevisionDate: 17/10/2012
SCREW1 SCREW2 = MECH_SCREW_M1.6x4: Screw; Part Number: BOSSARD_B1.6X4/BN660; Part Description: M1.6 L=4mm Philips Head Machine Screw, DIN 7985A, Stainless Steel A2; Manufacturer: BOSSARD; Manufacturer Part Number: B1.6X4/BN660; PressFit: No; Component Kind: Standard; Component Type: Mechanical; Pin Count: 0; PackageDescription: M1.6 L=4mm Philips Head Machine Screw, DIN 7985A, Stainless Steel A2; Mounted: Yes; Socket: No; SMD: No; Sense: No; Status: None; Value: M1.6x4; ComponentHeight: 1mm; HelpURL: \\cern.ch\dfs\Applications\Altium\Datasheets\BOSSARD_BN650-1243721.pdf; Author: GK; CreateDate: 04.12.2015; LatestRevisionDate: 04.12.2015
T1 = PMGD280UN: Dual N-Channel micro TrenchMOS™ Ultra Low Level FET; Part Description: 20V 870mA Dual N-Channel micro TrenchMOS™ Ultra Low Level FET; Manufacturer: NXP SEMICONDUCTORS; PressFit: No; Bonding: No; Part Number: PMGD280UN; Component Kind: Standard; Component Type: Standard; Device: PMGD280UN; PackageDescription: SOT363, SC70-6, SOT, 0.65mm Pitch, 6 pin, 1.25mm W X 2.00mm L X 1.10mm H, IPC Medium Density; Manufacturer Part Number: PMGD280UN; Pin Count: 6; Case: SOT363; Mounted: Yes; Socket: No; SMD: Yes; Sense: No; ComponentHeight: 1.1mm; HelpURL: \\cern.ch\dfs\Applications\Altium\Datasheets\PMGD280UN.pdf; Author: CERN DEM JLC; CreateDate: 19/11/2014; LatestRevisionDate: 19/11/2014
TP1 TP2 TP25-TP34 = SMD_PAD_1.27X1.27MM: Part Description: 1.27mm x 1.27mm PCB Copper Area (SMD Test Point); Mounted: No; Part Number: SMD_PAD_1.27X1.27MM; Component Type: Standard (No BOM); Pin Count: 1; Family: Test Point; Socket: No; SMD: Yes; Sense: No; Status: None; ComponentHeight: 0mm; HelpURL: Undefined; Author: CERN DEM JLC; CreateDate: 12.01.2008; LatestRevisionDate: 12.01.2008; PackageDescription: 1.27mm x 1.27mm PCB Copper Area (SMD Test Point)